# EAGLE schematic ADAS_schematic (EAGLE 9.1.1)
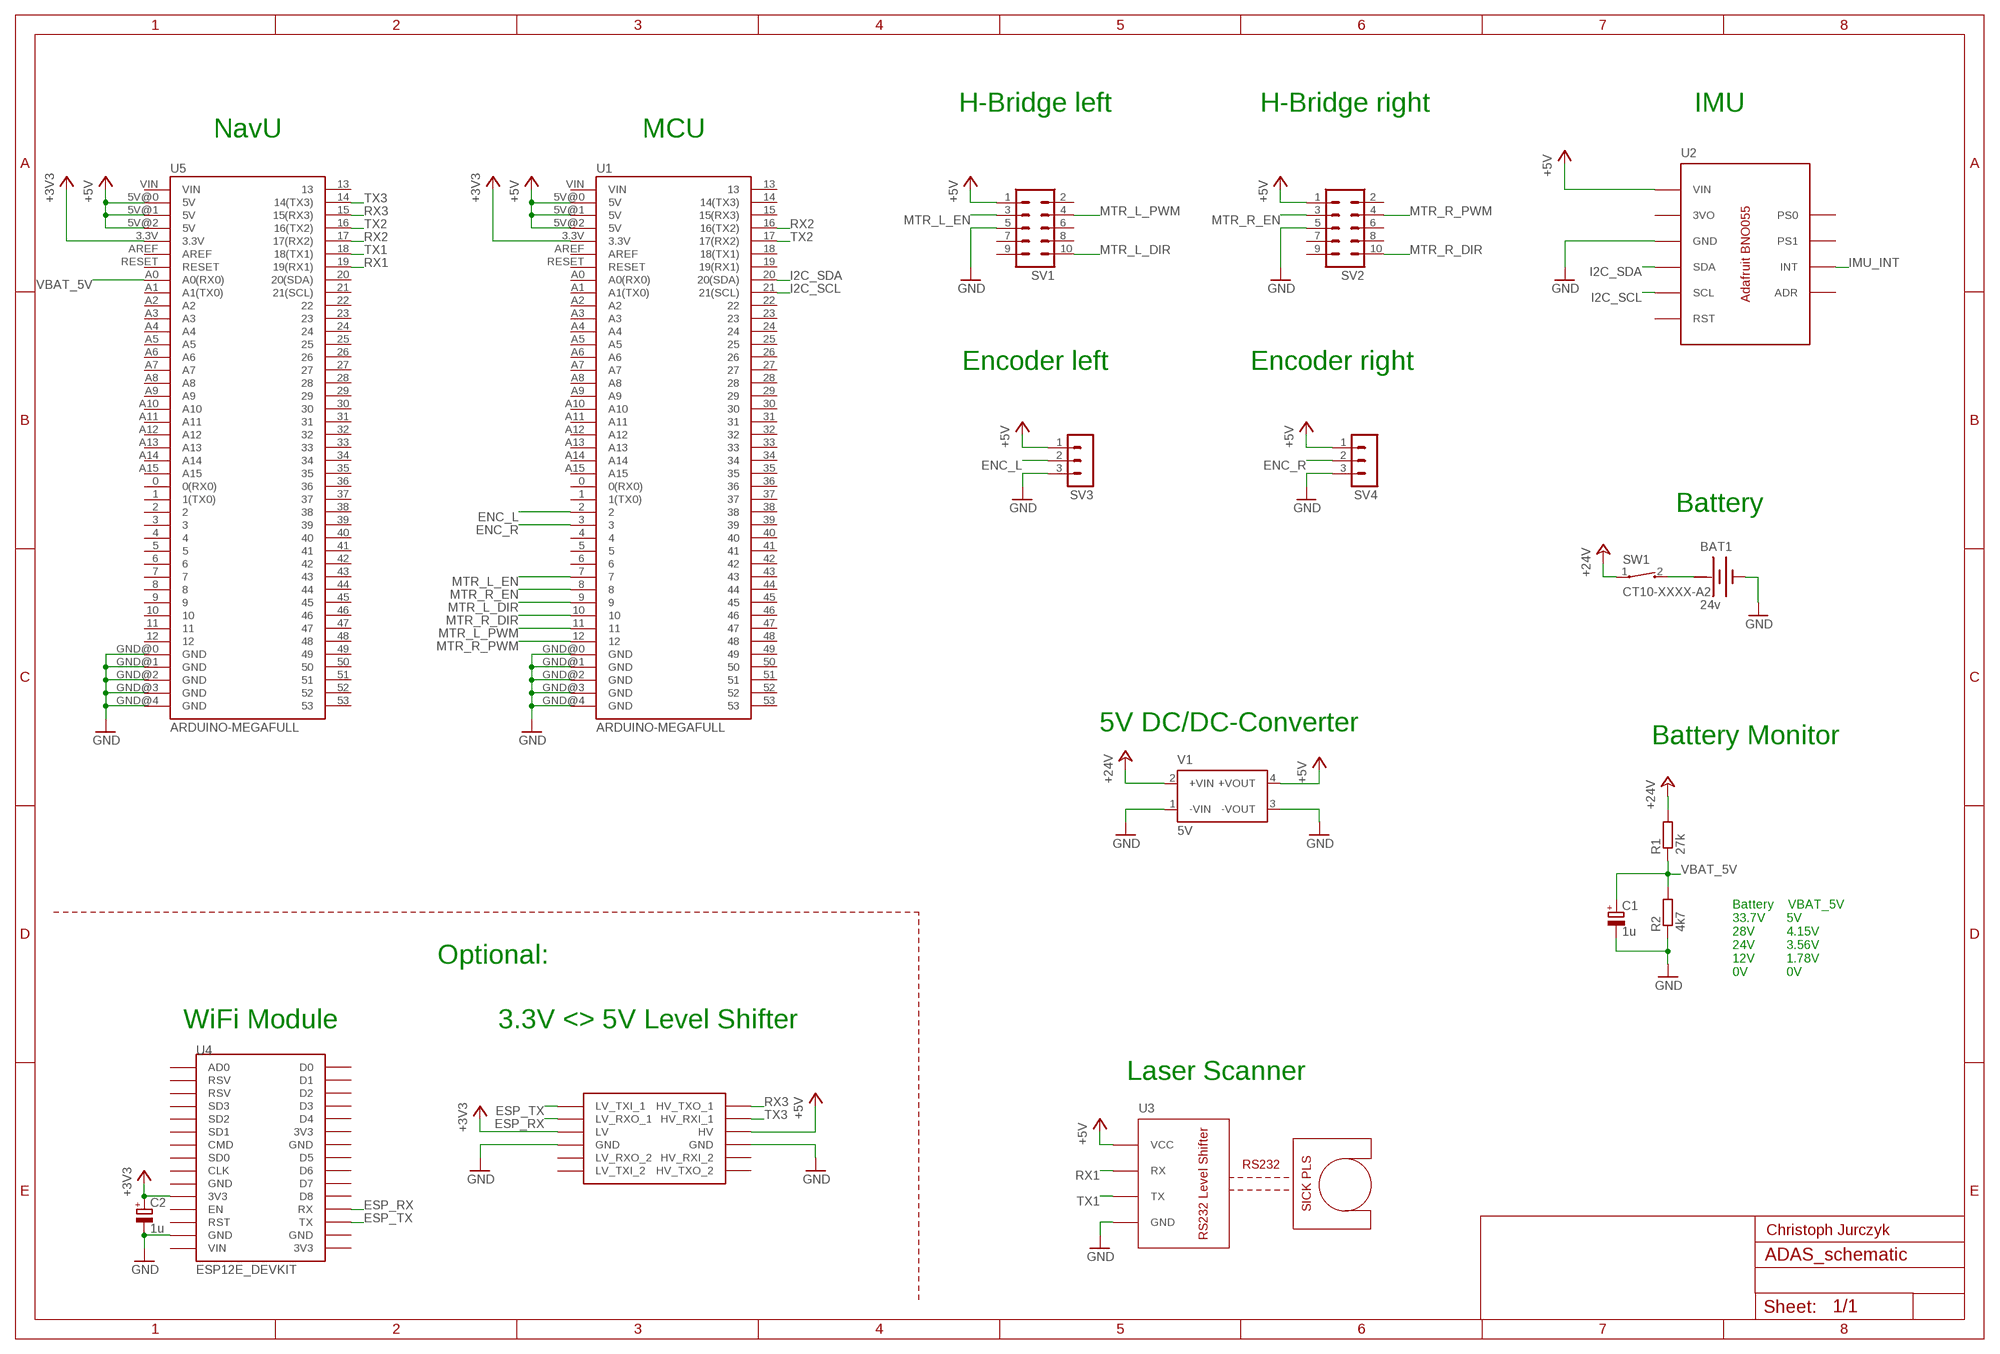
[diagram p0: schematic, sheet 1]

## Parts
BAT1  24v  BATTERY  [BATTERY]
C1  1u  CPOL-EU139CLL-3R  [139CLL-3R]
C2  1u  CPOL-EU139CLL-3R  [139CLL-3R]
R1  27k  R-EU_0617/22  [0617/22]
R2  4k7  R-EU_0617/22  [0617/22]
SV1  ML10  [ML10]
SV2  ML10  [ML10]
SV3  MA03-1  [MA03-1]
SV4  MA03-1  [MA03-1]
SW1  CT10-XXXX-A2  [CT10-XXXX-A2]
U1  ARDUINO-MEGAFULL  [ARDUINO_MEGA]
U2  ADAFRUIT_BNO055  [DUMMY]
U3  SICK_PLS  [DUMMY]
U4  ESP12E_DEVKIT  [ESP12E_DEVKIT]
U5  ARDUINO-MEGAFULL  [ARDUINO_MEGA]
U$2  LOGIC_LEVEL_CONVERTER  [LOGIC_LEVEL_CONVERTER]
V1  5V  TME0505S  [TME]

## Nets
+3V3: C2.+ U1.3.3V U4.3V3@0(3V3) U5.3.3V U$2.P$3(LV)
+5V: SV1.1 SV2.1 SV3.1 SV4.1 U1.5V@0(5V) U1.5V@1(5V) U1.5V@2(5V) U2.P$10(VIN) U3.P$4(VCC) U5.5V@0(5V) U5.5V@1(5V) U5.5V@2(5V) U$2.P$10(HV) V1.4(+VOUT)
+24V: R1.2 SW1.1 V1.2(+VIN)
ENC_L: SV3.2 U1.2
ENC_R: SV4.2 U1.3
ESP_RX: U4.RX U$2.P$2(LV_RXO_1)
ESP_TX: U4.TX U$2.P$1(LV_TXI_1)
GND: BAT1.- C1.- C2.- R2.1 SV1.5 SV2.5 SV3.3 SV4.3 U1.GND@0(GND) U1.GND@1(GND) U1.GND@2(GND) U1.GND@3(GND) U1.GND@4(GND) U2.P$3(GND) U3.P$1(GND) U4.GND@1(GND) U5.GND@0(GND) U5.GND@1(GND) U5.GND@2(GND) U5.GND@3(GND) U5.GND@4(GND) U$2.P$4(GND) U$2.P$9(GND) V1.1(-VIN) V1.3(-VOUT)
I2C_SCL: U1.21(21(SCL)) U2.P$8(SCL)
I2C_SDA: U1.20(20(SDA)) U2.P$9(SDA)
IMU_INT: U2.P$4(INT)
MTR_L_DIR: SV1.10 U1.9
MTR_L_EN: SV1.3 U1.7
MTR_L_PWM: SV1.4 U1.11
MTR_R_DIR: SV2.10 U1.10
MTR_R_EN: SV2.3 U1.8
MTR_R_PWM: SV2.4 U1.12
N$1: BAT1.+ SW1.2
RX1: U3.P$2(RX) U5.19(19(RX1))
RX2: U1.16(16(TX2)) U5.17(17(RX2))
RX3: U5.15(15(RX3)) U$2.P$12(HV_TXO_1)
TX1: U3.P$3(TX) U5.18(18(TX1))
TX2: U1.17(17(RX2)) U5.16(16(TX2))
TX3: U5.14(14(TX3)) U$2.P$11(HV_RXI_1)
VBAT_5V: C1.+ R1.1 R2.2 U5.A0(A0(RX0))
Unconnected: SV1.2 SV1.6 SV1.7 SV1.8 SV1.9 SV2.2 SV2.6 SV2.7 SV2.8 SV2.9 U1.0(0(RX0)) U1.1(1(TX0)) U1.4 U1.5 U1.6 U1.13 U1.14(14(TX3)) U1.15(15(RX3)) U1.18(18(TX1)) U1.19(19(RX1)) U1.22 U1.23 U1.24 U1.25 U1.26 U1.27 U1.28 U1.29 U1.30 U1.31 U1.32 U1.33 U1.34 U1.35 U1.36 U1.37 U1.38 U1.39 U1.40 U1.41 U1.42 U1.43 U1.44 U1.45 U1.46 U1.47 U1.48 U1.49 U1.50 U1.51 U1.52 U1.53 U1.A0(A0(RX0)) U1.A1(A1(TX0)) U1.A2 U1.A3 U1.A4 U1.A5 U1.A6 U1.A7 U1.A8 U1.A9 U1.A10 U1.A11 U1.A12 U1.A13 U1.A14 U1.A15 U1.AREF U1.RESET U1.VIN U2.P$1(3VO) U2.P$2(ADR) U2.P$5(PS0) U2.P$6(PS1) U2.P$7(RST) U4.3V3@1(3V3) U4.3V3@2(3V3) U4.AD0 U4.CLK U4.CMD U4.D0 U4.D1 U4.D2 U4.D3 U4.D4 U4.D5 U4.D6 U4.D7 U4.D8 U4.EN U4.GND@0(GND) U4.GND@2(GND) U4.GND@3(GND) U4.RST U4.RSV@0(RSV) U4.RSV@1(RSV) U4.SD0 U4.SD1 U4.SD2 U4.SD3 U4.VIN U5.0(0(RX0)) U5.1(1(TX0)) U5.2 U5.3 U5.4 U5.5 U5.6 U5.7 U5.8 U5.9 U5.10 U5.11 U5.12 U5.13 U5.20(20(SDA)) U5.21(21(SCL)) U5.22 U5.23 U5.24 U5.25 U5.26 U5.27 U5.28 U5.29 U5.30 U5.31 U5.32 U5.33 U5.34 U5.35 U5.36 U5.37 U5.38 U5.39 U5.40 U5.41 U5.42 U5.43 U5.44 U5.45 U5.46 U5.47 U5.48 U5.49 U5.50 U5.51 U5.52 U5.53 U5.A1(A1(TX0)) U5.A2 U5.A3 U5.A4 U5.A5 U5.A6 U5.A7 U5.A8 U5.A9 U5.A10 U5.A11 U5.A12 U5.A13 U5.A14 U5.A15 U5.AREF U5.RESET U5.VIN U$2.P$5(LV_RXO_2) U$2.P$6(LV_TXI_2) U$2.P$7(HV_TXO_2) U$2.P$8(HV_RXI_2)

## Notes on the sheet
- H-Bridge left | H-Bridge right | IMU
- NavU | MCU
- Encoder left | Encoder right
- Battery
- 5V DC/DC-Converter
- Battery Monitor
- Battery    VBAT_5V
  33.7V      5V
  28V         4.15V
  24V         3.56V
  12V         1.78V
  0V           0V
- Optional:
- WiFi Module | 3.3V <> 5V Level Shifter
- Laser Scanner
- Christoph Jurczyk

## Power pins joined to a net without a drawn wire
+: BAT1.+@1(+)

## Library data of the parts
BAT1 = special:BATTERY: BATTERY
C1 C2 = rcl:CPOL-EU: POLARIZED CAPACITOR, European symbol; SPICEPREFIX: C
R1 R2 = rcl:R-EU_: RESISTOR, European symbol; SPICEPREFIX: R
SV1 SV2 = con-ml:ML10: HARTING; OC_FARNELL: unknown; OC_NEWARK: unknown
SV3 SV4 = con-lstb:MA03-1: PIN HEADER; OC_FARNELL: unknown; OC_NEWARK: unknown
SW1 = switch-coto:CT10-XXXX-: CT10 Series Molded Switch Source: www.cotorelay.com .. Coto_Technology__CT10-1530-G1.pdf
U1 U5 = SparkFun-Boards:ARDUINO-MEGA: Arduino Mega board footprint
U2 = BNO055_breakout:ADAFRUIT_BNO055
U3 = BNO055_breakout:SICK_PLS
U4 = ESP12E_DEVKIT:ESP12E_DEVKIT: ESP12E DEVKIT BOARD
U$2 = SparkFun-Boards:LOGIC_LEVEL_CONVERTER: Logic Level Converter (3.3v - 5v) https://www.sparkfun.com/products/8745
V1 = traco-electronic:TME?*: DC/DC Converter TME Series 1 Watt Source: www.tracopower.com .. tme.pdf; MPN: TME 0505S; OC_FARNELL: 1007538; OC_NEWARK: 51R5321